# Altium schematic sheet Flash-Memory.SchDoc
size A; SheetNumber: 8; SheetTotal: 9
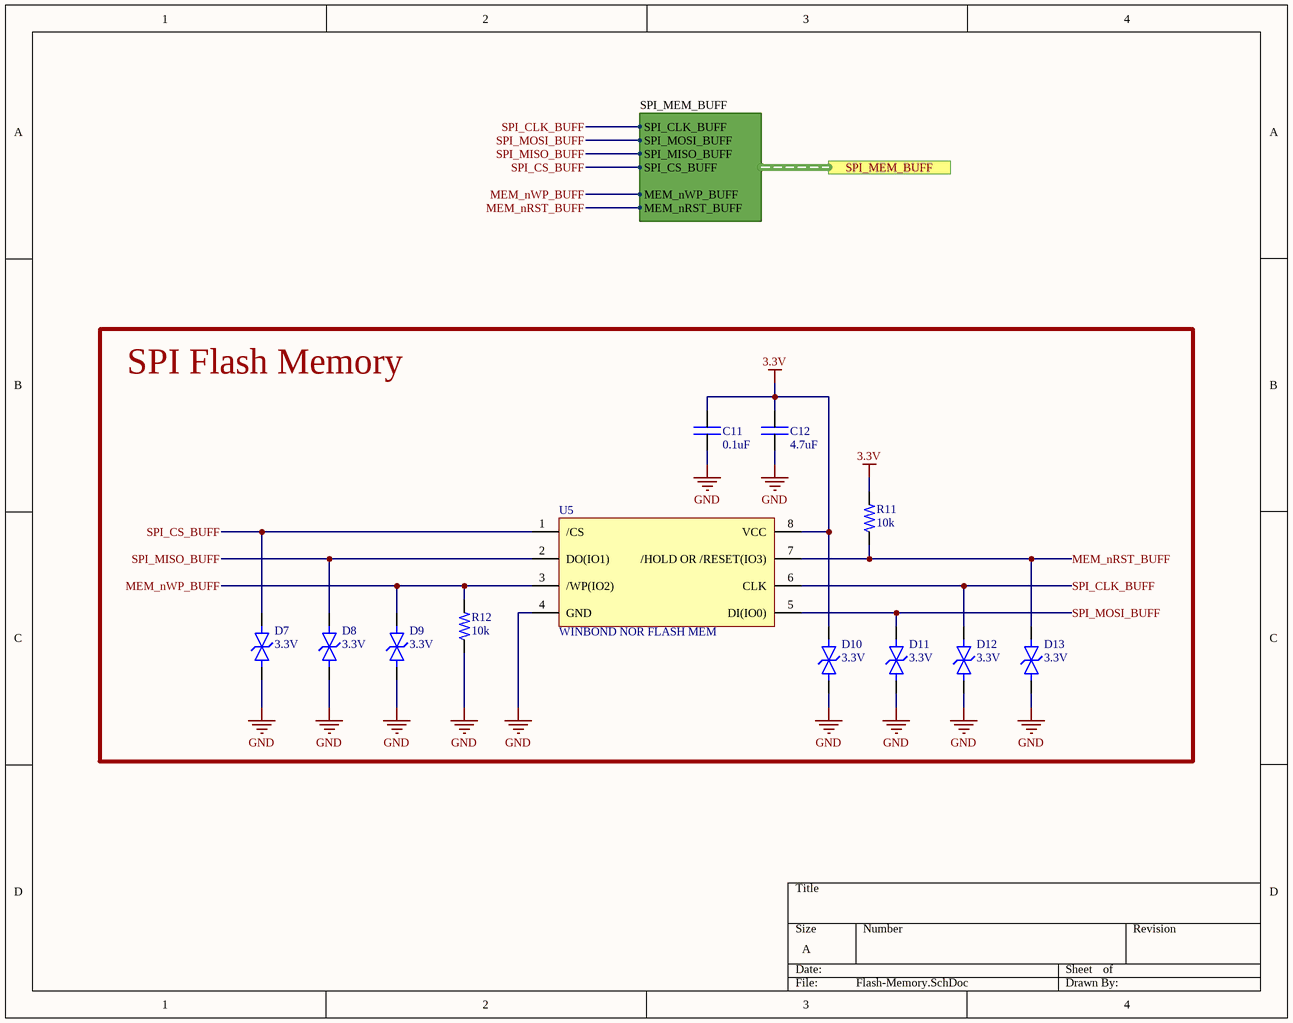
[diagram p0: Flash-Memory.SchDoc]

## Parts
C11  value 0.1uF  [0402C]  (hidden comment: CAP)
C12  value 4.7uF  [0402C]  (hidden comment: CAP)
D7  VRS: 3.3V  [0402-TVS]  (hidden comment: DESD3V3E1BL-7B)
D8  VRS: 3.3V  [0402-TVS]  (hidden comment: DESD3V3E1BL-7B)
D9  VRS: 3.3V  [0402-TVS]  (hidden comment: DESD3V3E1BL-7B)
D10  VRS: 3.3V  [0402-TVS]  (hidden comment: DESD3V3E1BL-7B)
D11  VRS: 3.3V  [0402-TVS]  (hidden comment: DESD3V3E1BL-7B)
D12  VRS: 3.3V  [0402-TVS]  (hidden comment: DESD3V3E1BL-7B)
D13  VRS: 3.3V  [0402-TVS]  (hidden comment: DESD3V3E1BL-7B)
R11  value 10k  [0402R]  (hidden comment: RES)
R12  value 10k  [0402R]  (hidden comment: RES)
U5  WINBOND NOR FLASH MEM  [8-SOIC]

## Blocks framed on the sheet
SPI Flash Memory: C11 C12 D7-D13 R11 R12 U5

## Ports
SPI_MEM_BUFF (harness SPI_MEM_BUFF, see Christmas-2024_TSO-PCB_MASTER[1B], Memory-Buffer[4B])

## Harnesses
SPI_MEM_BUFF: SPI_CLK_BUFF, SPI_MOSI_BUFF, SPI_MISO_BUFF, SPI_CS_BUFF, MEM_nWP_BUFF, MEM_nRST_BUFF

## Nets
3.3V: C11.2 C12.2 D10.1 R11.2 U5.8(VCC)
GND: C11.1 C12.1 D7.2 D8.2 D9.2 D10.2 D11.2 D12.2 D13.2 R12.1 U5.4(GND)
MEM_nRST_BUFF: D13.1 R11.1 U5.7(/HOLD_OR_/RESET(IO3)) ; port SPI_MEM_BUFF.MEM_nRST_BUFF
MEM_nWP_BUFF: D9.1 R12.2 U5.3(/WP(IO2)) ; port SPI_MEM_BUFF.MEM_nWP_BUFF
SPI_CLK_BUFF: D12.1 U5.6(CLK) ; port SPI_MEM_BUFF.SPI_CLK_BUFF
SPI_CS_BUFF: D7.1 U5.1(/CS) ; port SPI_MEM_BUFF.SPI_CS_BUFF
SPI_MISO_BUFF: D8.1 U5.2(DO(IO1)) ; port SPI_MEM_BUFF.SPI_MISO_BUFF
SPI_MOSI_BUFF: D11.1 U5.5(DI(IO0)) ; port SPI_MEM_BUFF.SPI_MOSI_BUFF

## Library data of the parts
C11 = CAP: Capacitor; MFR: Samsung; MFR PN: CL05B104KP5NNNC; Type: SMD
C12 = CAP: Capacitor; MFR: Samsung; MFR PN: CL05A475MP5NRNC; Type: SMD
D7-D13 = TVS Diode 3.3V Bi: TVS DIODE 3.3VWM 7VC DFN1006-2; MFR: Diodes Incorporated; Type: SMD; VBR: 3.8V; VC: 7V; MFR PN: DESD3V3E1BL-7B
R11 R12 = RES: Resistor; MFR PN: RC0402JR-0710KL; MFR: YAGEO; Type: SMD
U5 = WINBOND NOR FLASH MEM: FLASH - NOR Memory IC SPI, 128 Mbit; MFR PN: W25Q128JVSIM; MFR: Winbond; Type: SMD; Value: *